# Altium schematic sheet EMMC.SchDoc
size A3; SheetNumber: 13; SheetTotal: 20
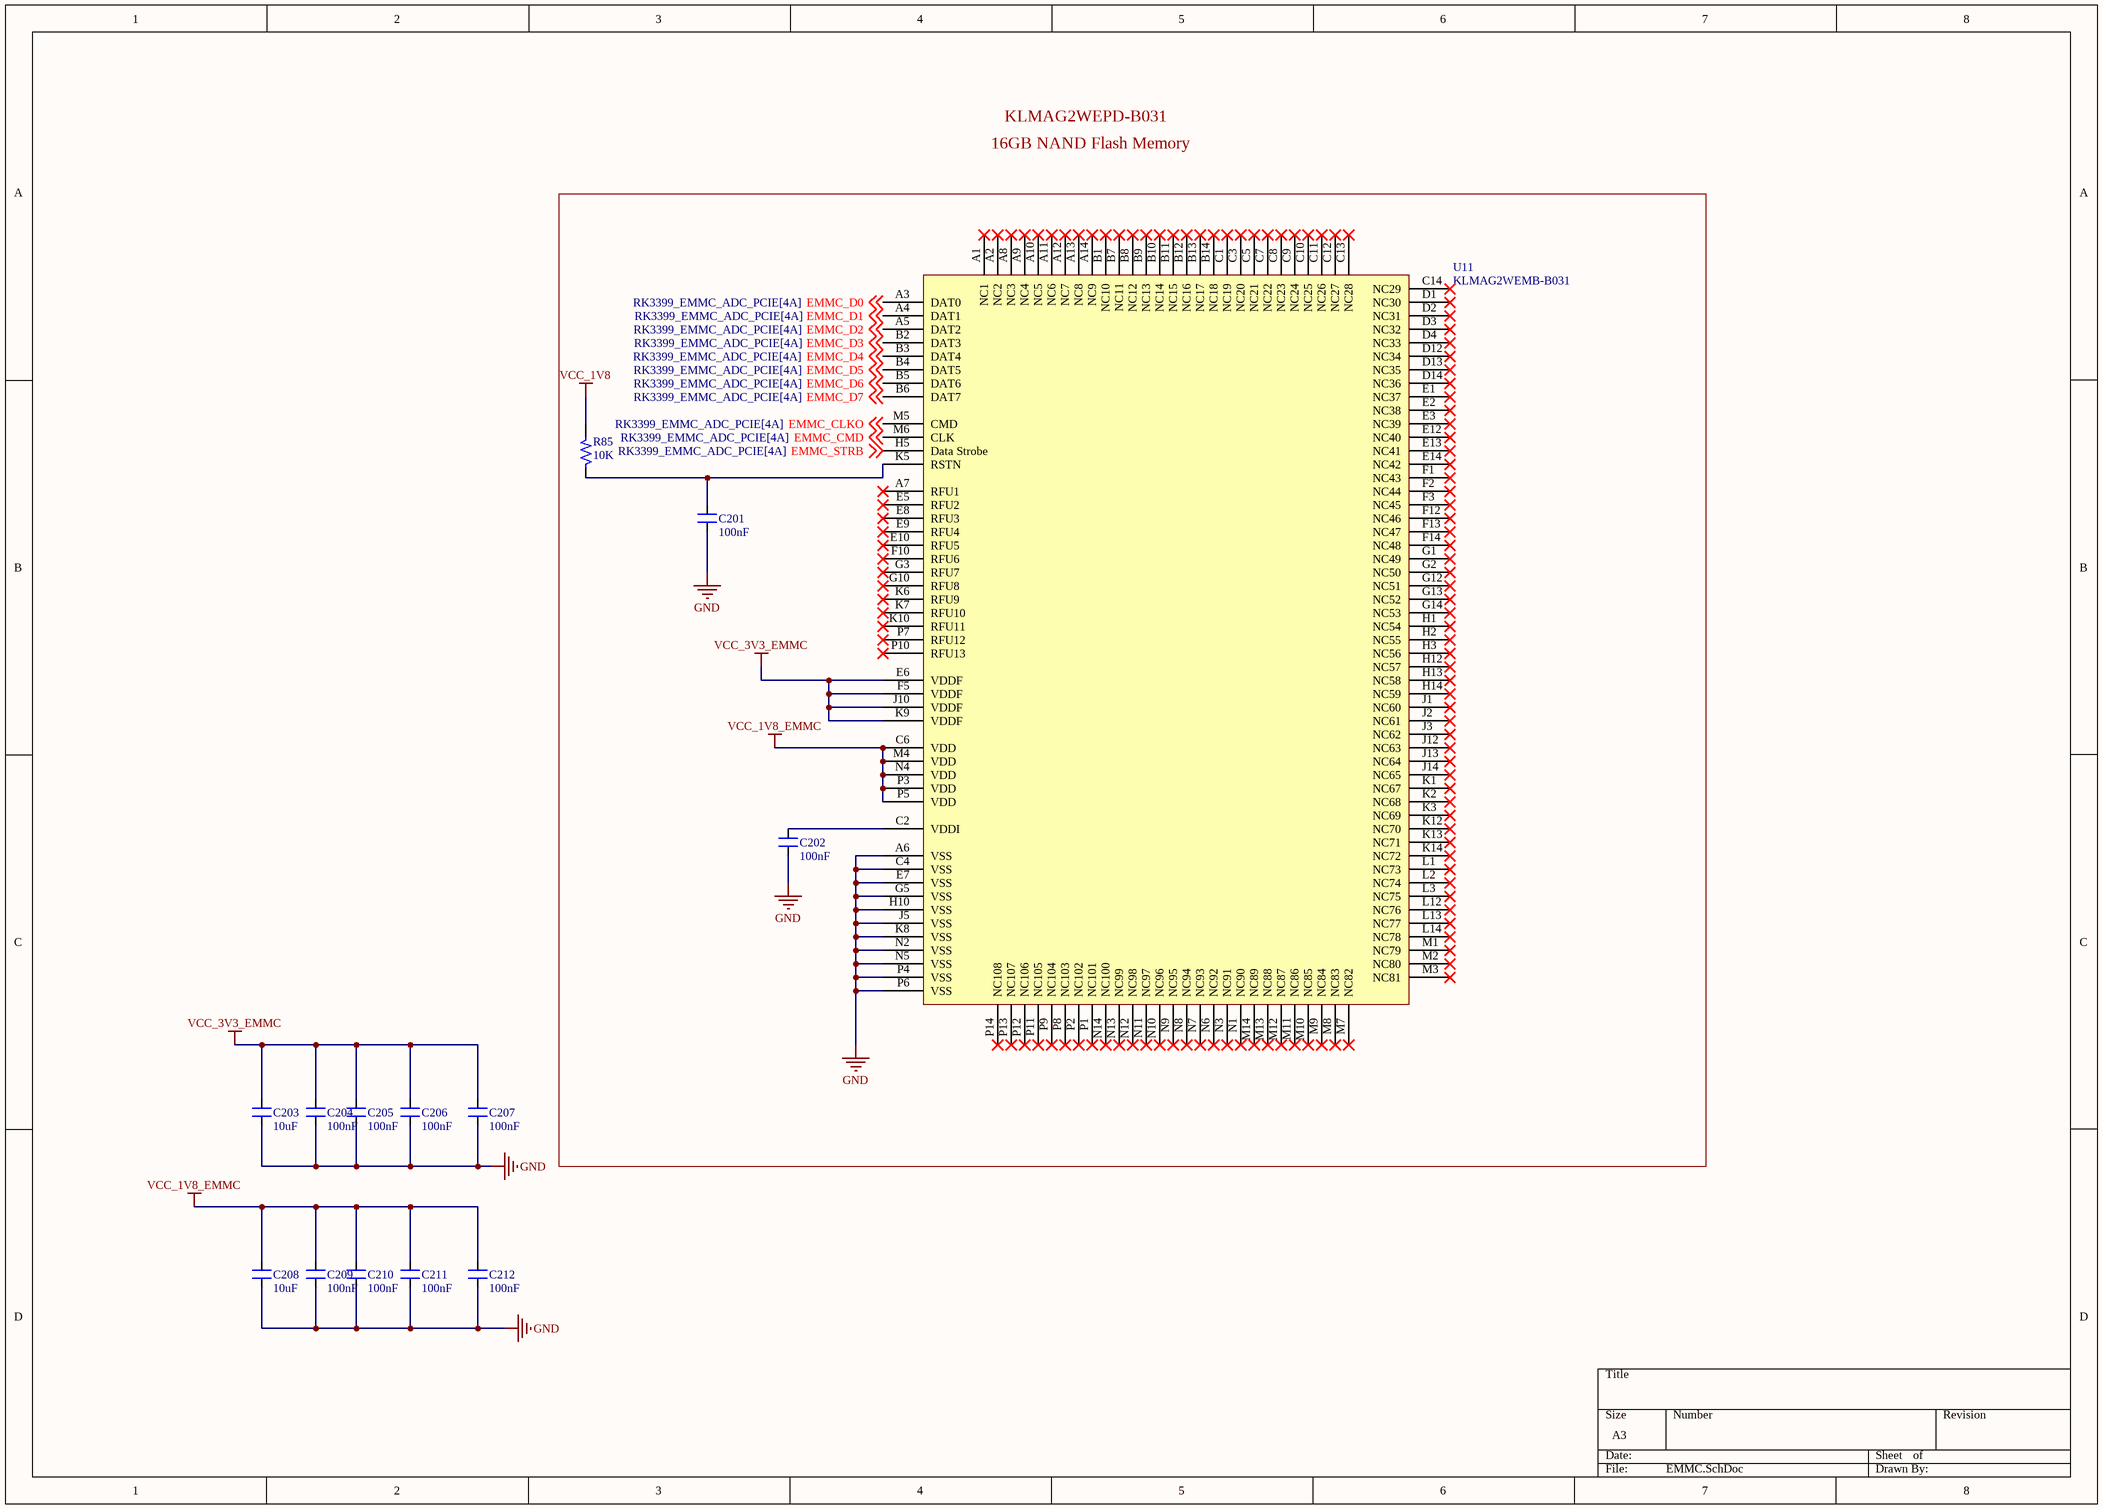
[diagram p0: EMMC.SchDoc]

## Parts
C201  100nF  [CAP_0201]
C202  100nF  [CAP_0201]
C203  10uF  [CAP_0603]
C204  100nF  [CAP_0201]
C205  100nF  [CAP_0201]
C206  100nF  [CAP_0201]
C207  100nF  [CAP_0201]
C208  10uF  [CAP_0603]
C209  100nF  [CAP_0201]
C210  100nF  [CAP_0201]
C211  100nF  [CAP_0201]
C212  100nF  [CAP_0201]
R85  10K  [RES_0201]
U11  KLMAG2WEMB-B031  [BGA153C50P14X14_1150X1300X70]

## Nets
GND: C201.2 C202.2 C203.1 C204.2 C205.2 C206.2 C207.2 C208.1 C209.2 C210.2 C211.2 C212.2 U11.A6(VSS) U11.C4(VSS) U11.E7(VSS) U11.G5(VSS) U11.H10(VSS) U11.J5(VSS) U11.K8(VSS) U11.N2(VSS) U11.N5(VSS) U11.P4(VSS) U11.P6(VSS)
VCC_1V8: R85.2
VCC_1V8_EMMC: C208.2 C209.1 C210.1 C211.1 C212.1 U11.C6(VDD) U11.M4(VDD) U11.N4(VDD) U11.P3(VDD) U11.P5(VDD)
VCC_3V3_EMMC: C203.2 C204.1 C205.1 C206.1 C207.1 U11.E6(VDDF) U11.F5(VDDF) U11.J10(VDDF) U11.K9(VDDF)
EMMC_CLKO: U11.M5(CMD) ; off-sheet EMMC_CLKO
EMMC_CMD: U11.M6(CLK) ; off-sheet EMMC_CMD
EMMC_D0: U11.A3(DAT0) ; off-sheet EMMC_D0
EMMC_D1: U11.A4(DAT1) ; off-sheet EMMC_D1
EMMC_D2: U11.A5(DAT2) ; off-sheet EMMC_D2
EMMC_D3: U11.B2(DAT3) ; off-sheet EMMC_D3
EMMC_D4: U11.B3(DAT4) ; off-sheet EMMC_D4
EMMC_D5: U11.B4(DAT5) ; off-sheet EMMC_D5
EMMC_D6: U11.B5(DAT6) ; off-sheet EMMC_D6
EMMC_D7: U11.B6(DAT7) ; off-sheet EMMC_D7
EMMC_STRB: U11.H5(Data_Strobe) ; off-sheet EMMC_STRB
NetC201_1: C201.1 R85.1 U11.K5(RSTN)
NetC202_1: C202.1 U11.C2(VDDI)

Not connected (* = marked no-connect by the designer): U11 A1(NC1)* A2(NC2)* A7(RFU1)* A8(NC3)* A9(NC4)* A10(NC5)* A11(NC6)* A12(NC7)* A13(NC8)* A14(NC9)* B1(NC10)* B7(NC11)* B8(NC12)* B9(NC13)* B10(NC14)* B11(NC15)* B12(NC16)* B13(NC17)* B14(NC18)* C1(NC19)* C3(NC20)* C5(NC21)* C7(NC22)* C8(NC23)* C9(NC24)* C10(NC25)* C11(NC26)* C12(NC27)* C13(NC28)* C14(NC29)* D1(NC30)* D2(NC31)* D3(NC32)* D4(NC33)* D12(NC34)* D13(NC35)* D14(NC36)* E1(NC37)* E2(NC38)* E3(NC39)* E5(RFU2)* E8(RFU3)* E9(RFU4)* E10(RFU5)* E12(NC40)* E13(NC41)* E14(NC42)* F1(NC43)* F2(NC44)* F3(NC45)* F10(RFU6)* F12(NC46)* F13(NC47)* F14(NC48)* G1(NC49)* G2(NC50)* G3(RFU7)* G10(RFU8)* G12(NC51)* G13(NC52)* G14(NC53)* H1(NC54)* H2(NC55)* H3(NC56)* H12(NC57)* H13(NC58)* H14(NC59)* J1(NC60)* J2(NC61)* J3(NC62)* J12(NC63)* J13(NC64)* J14(NC65)* K1(NC67)* K2(NC68)* K3(NC69)* K6(RFU9)* K7(RFU10)* K10(RFU11)* K12(NC70)* K13(NC71)* K14(NC72)* L1(NC73)* L2(NC74)* L3(NC75)* L12(NC76)* L13(NC77)* L14(NC78)* M1(NC79)* M2(NC80)* M3(NC81)* M7(NC82)* M8(NC83)* M9(NC84)* M10(NC85)* M11(NC86)* M12(NC87)* M13(NC88)* M14(NC89)* N1(NC90)* N3(NC91)* N6(NC92)* N7(NC93)* N8(NC94)* N9(NC95)* N10(NC96)* N11(NC97)* N12(NC98)* N13(NC99)* N14(NC100)* P1(NC101)* P2(NC102)* P7(RFU12)* P8(NC103)* P9(NC104)* P10(RFU13)* P11(NC105)* P12(NC106)* P13(NC107)* P14(NC108)*

## Notes on the sheet
- 16GB NAND Flash Memory
- KLMAG2WEPD-B031

## Library data of the parts
C201 C202 C204-C207 C209-C212 = CAP_100nF-25V-10%-0201: 0.1µF ±10% 25V Ceramic Capacitor X5R 0201 (0603 Metric); Manufacturer: TDK Corporation; Manufacturer Part Number: C0603X5R1E104K030BB; Case/Package: 0201; Supplier-1: Digikey
C203 C208 = CAP_10uF-10V-10%-0603: 10µF ±10% 10V Ceramic Capacitor X5R 0603 (1608 Metric); Manufacturer Part Number: GRM188R61A106KE69J; Manufacturer: Murata Electronics; Case/Package: 0603; Supplier-1: Digikey
R85 = RES_10K-0.05W-1%-0201: 10 kOhms ±1% 0.05W, 1/20W Chip Resistor 0201 (0603 Metric) Thick Film; Manufacturer: Stackpole Electronics Inc; Manufacturer Part Number: RMCF0201FT10K0; Case/Package: 0201; Supplier-1: Digikey
U11 = IC_KLMAG2WEMB-B031: 16GB NAND Flash Memory; Manufacturer: Samsung Electronics; Manufacturer Part Number: KLMAG2WEMB-B031; Case/Package: 153-FBGA; Supplier-1: NA